# EAGLE design CONTROL PROJECT (EAGLE 7.7.0)
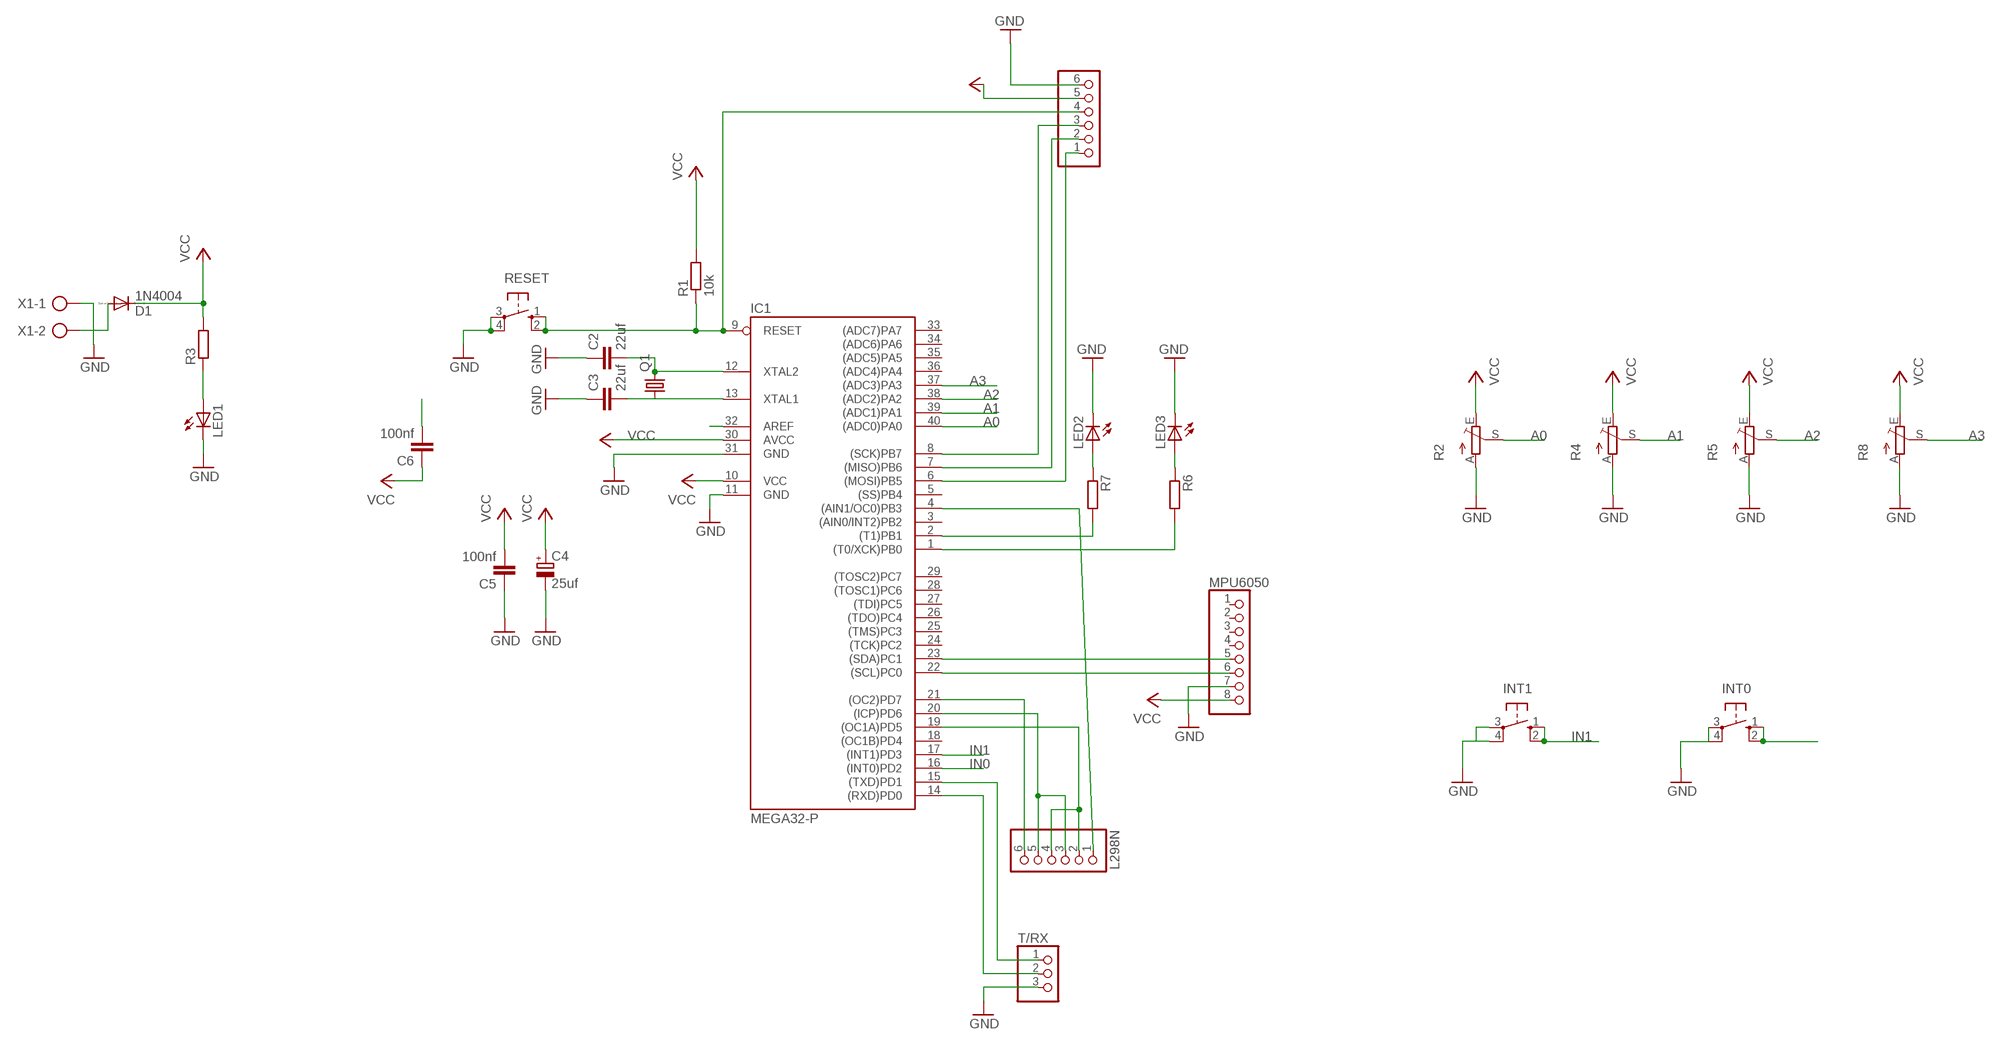
[diagram p0: schematic, sheet 1]

## Parts
C2  22uf  C-EU050-025X075  [C050-025X075]
C3  22uf  C-EU050-025X075  [C050-025X075]
C4  25uf  CPOL-EUE1.8-4  [E1,8-4]
C5  100nf  C-EU050-025X075  [C050-025X075]
C6  100nf  C-EU050-025X075  [C050-025X075]
D1  1N4004  [DO41-10]
IC1  MEGA32-P  [DIL40]
INT0  10-XX  [B3F-10XX]
INT1  10-XX  [B3F-10XX]
L298N  PINHD-1X6  [1X06]
LED1  LED5MM  [LED5MM]
LED2  LED5MM  [LED5MM]
LED3  LED5MM  [LED5MM]
MPU6050  PINHD-1X8  [1X08]
PROG  PINHD-1X6  [1X06]
Q1  CRYSTALHC49U-V  [HC49U-V]
R1  10k  R-EU_0207/7  [0207/7]
R2  TRIM_EU-RJ6  [RJ6]
R3  R-EU_0207/7  [0207/7]
R4  TRIM_EU-RJ6  [RJ6]
R5  TRIM_EU-RJ6  [RJ6]
R6  R-EU_0207/7  [0207/7]
R7  R-EU_0207/7  [0207/7]
R8  TRIM_EU-RJ6  [RJ6]
RESET  10-XX  [B3F-10XX]
T/RX  PINHD-1X3  [1X03]
X1  AK300/2  [AK300/2]

## Nets
A0: IC1.40((ADC0)PA0) R2.S
A1: IC1.39((ADC1)PA1) R4.S
A2: IC1.38((ADC2)PA2) R5.S
A3: IC1.37((ADC3)PA3) R8.S
AREF: C6.2 IC1.32(AREF)
GND: C2.1 C3.1 C4.- C5.1 IC1.11(GND) IC1.31(GND) INT0.3(P) INT0.4(P1) INT1.3(P) INT1.4(P1) LED1.K(C) LED2.K(C) LED3.K(C) MPU6050.7 PROG.6 R2.A R4.A R5.A R8.A RESET.3(P) RESET.4(P1) T/RX.3 X1.1
IN0: IC1.16((INT0)PD2) INT0.1(S) INT0.2(S1)
IN1: IC1.17((INT1)PD3) INT1.1(S) INT1.2(S1)
MISO: IC1.7((MISO)PB6) PROG.2
MOSI: IC1.6((MOSI)PB5) PROG.1
N$2: C2.2 IC1.12(XTAL2) Q1.2
N$3: C3.2 IC1.13(XTAL1) Q1.1
N$4: IC1.2((T1)PB1) R7.2
N$5: LED1.A R3.1
N$6: D1.A X1.2
N$7: IC1.1((T0/XCK)PB0) R6.2
N$8: LED3.A R6.1
N$9: LED2.A R7.1
N$12: IC1.19((OC1A)PD5) L298N.2 L298N.4
N$14: IC1.20((ICP)PD6) L298N.3 L298N.5
OC0: IC1.4((AIN1/OC0)PB3) L298N.1
OC2: IC1.21((OC2)PD7) L298N.6
RESET: IC1.9(RESET) PROG.4 R1.1 RESET.1(S) RESET.2(S1)
RX: IC1.14((RXD)PD0) T/RX.2
SCK: IC1.8((SCK)PB7) PROG.3
SCL: IC1.22((SCL)PC0) MPU6050.6
SDA: IC1.23((SDA)PC1) MPU6050.5
TX: IC1.15((TXD)PD1) T/RX.1
VCC: C4.+ C5.2 C6.1 D1.C IC1.10(VCC) IC1.30(AVCC) MPU6050.8 PROG.5 R1.2 R2.E R3.2 R4.E R5.E R8.E
Unconnected: IC1.3((AIN0/INT2)PB2) IC1.5((SS)PB4) IC1.18((OC1B)PD4) IC1.24((TCK)PC2) IC1.25((TMS)PC3) IC1.26((TDO)PC4) IC1.27((TDI)PC5) IC1.28((TOSC1)PC6) IC1.29((TOSC2)PC7) IC1.33((ADC7)PA7) IC1.34((ADC6)PA6) IC1.35((ADC5)PA5) IC1.36((ADC4)PA4) MPU6050.1 MPU6050.2 MPU6050.3 MPU6050.4

## Library data of the parts
C2 C3 C5 C6 = rcl:C-EU: CAPACITOR, European symbol
C4 = resistor:CPOL-EU: POLARIZED CAPACITOR, European symbol
D1 = diode:1N4004: DIODE general purpose rectifier, 1 A
IC1 = atmel:MEGA32-P: MICROCONTROLLER 32 Kbytes FLASH 2 Kbytes SRAM 1 Kbytes EEPROM USART 8-channel 10 bit ADC Source: www.atmel.com .. doc2503.pdf; MPN: ATMEGA32-16PU; OC_FARNELL: 1661729; OC_NEWARK: 51P1794
INT0 INT1 RESET = switch-omron:10-XX: OMRON SWITCH; MPN: B3F-1000; OC_FARNELL: 176432; OC_NEWARK: 36M3542
L298N PROG = pinhead:PINHD-1X6: PIN HEADER
LED1-LED3 = led:LED: LED OSRAM: - CHIPLED LG R971, LG N971, LY N971, LG Q971, LY Q971, LO R971, LY R971 LH N974, LH R974 LS Q976, LO Q976, LY Q976 LO Q996 - Hyper CHIPLED LW Q18S LB Q993, LB Q99A, LB R99A - SideLED LS A670, LO A670, LY A670, LG A670, LP A670 LB A673, LV A673, LT A673, LW A673 LH A674 LY A675 LS A676, LA A676, LO A676, LY A676, LW A676 LS A679, LY A679, LG A679 - Hyper Micro SIDELED® LS Y876, LA Y876, LO Y876, LY Y876 LT Y87S - SmartLED LW L88C, LW L88S LB L89C, LB L89S, LG L890 LS L89K, LO L89K, LY L89K LS L896, LA L896, LO L896, LY L896 - TOPLED LS T670, LO T670, LY T670, LG T670, LP T670 LSG T670, LSP T670, LSY T670, LOP T670, LYG T670 LG T671, LOG T671, LSG T671 LB T673, LV T673, LT T673, LW T673 LH T674 LS T676, LA T676, LO T676, LY T676, LB T676, LH T676, LSB T676, LW T676 LB T67C, LV T67C, LT T67C, LS T67K, LO T67K, LY T67K, LW E67C LS E67B, LA E67B, LO E67B, LY E67B, LB E67C, LV E67C, LT E67C LW T67C LS T679, LY T679, LG T679 LS T770, LO T770, LY T770, LG T770, LP T770 LB T773, LV T773, LT T773, LW T773 LH T774 LS E675, LA E675, LY E675, LS T675 LS T776, LA T776, LO T776, LY T776, LB T776 LHGB T686 LT T68C, LB T68C - Hyper Mini TOPLED® LB M676 - Mini TOPLED Santana® LG M470 LS M47K, LO M47K, LY M47K Source: http://www.osram.convergy.de LUXEON: - LUMILED® LXK2-PW12-R00, LXK2-PW12-S00, LXK2-PW14-U00, LXK2-PW14-V00 LXK2-PM12-R00, LXK2-PM12-S00, LXK2-PM14-U00 LXK2-PE12-Q00, LXK2-PE12-R00, LXK2-PE12-S00, LXK2-PE14-T00, LXK2-PE14-U00 LXK2-PB12-K00, LXK2-PB12-L00, LXK2-PB12-M00, LXK2-PB14-N00, LXK2-PB14-P00, LXK2-PB14-Q00 LXK2-PR12-L00, LXK2-PR12-M00, LXK2-PR14-Q00, LXK2-PR14-R00 LXK2-PD12-Q00, LXK2-PD12-R00, LXK2-PD12-S00 LXK2-PH12-R00, LXK2-PH12-S00 LXK2-PL12-P00, LXK2-PL12-Q00, LXK2-PL12-R00 Source: www.luxeon.com KINGBRIGHT: KA-3528ASYC Source: www.kingbright.com
MPU6050 = pinhead@1:PINHD-1X8: PIN HEADER
Q1 = crystal:CRYSTAL: CRYSTAL; OC_FARNELL: 1666969; OC_NEWARK: unknown
R1 R3 R6 R7 = rcl:R-EU_: RESISTOR, European symbol
R2 R4 R5 R8 = pot:TRIM_EU-: POTENTIOMETER
T/RX = pinhead:PINHD-1X3: PIN HEADER
X1 = con-ptr500:AK300/2: CONNECTOR; OC_FARNELL: unknown; OC_NEWARK: unknown

## Board
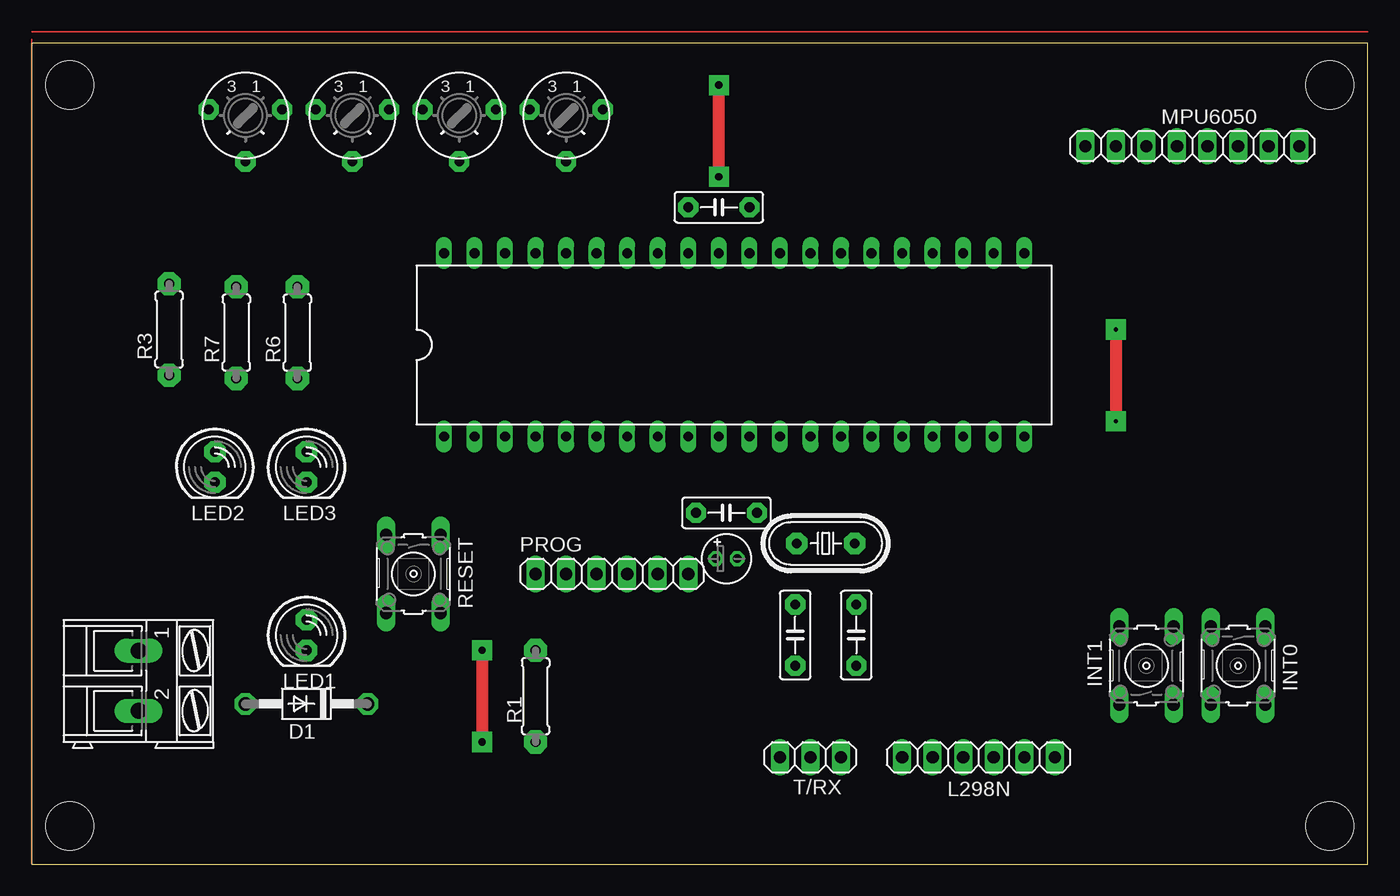
[diagram p1: board, top side]
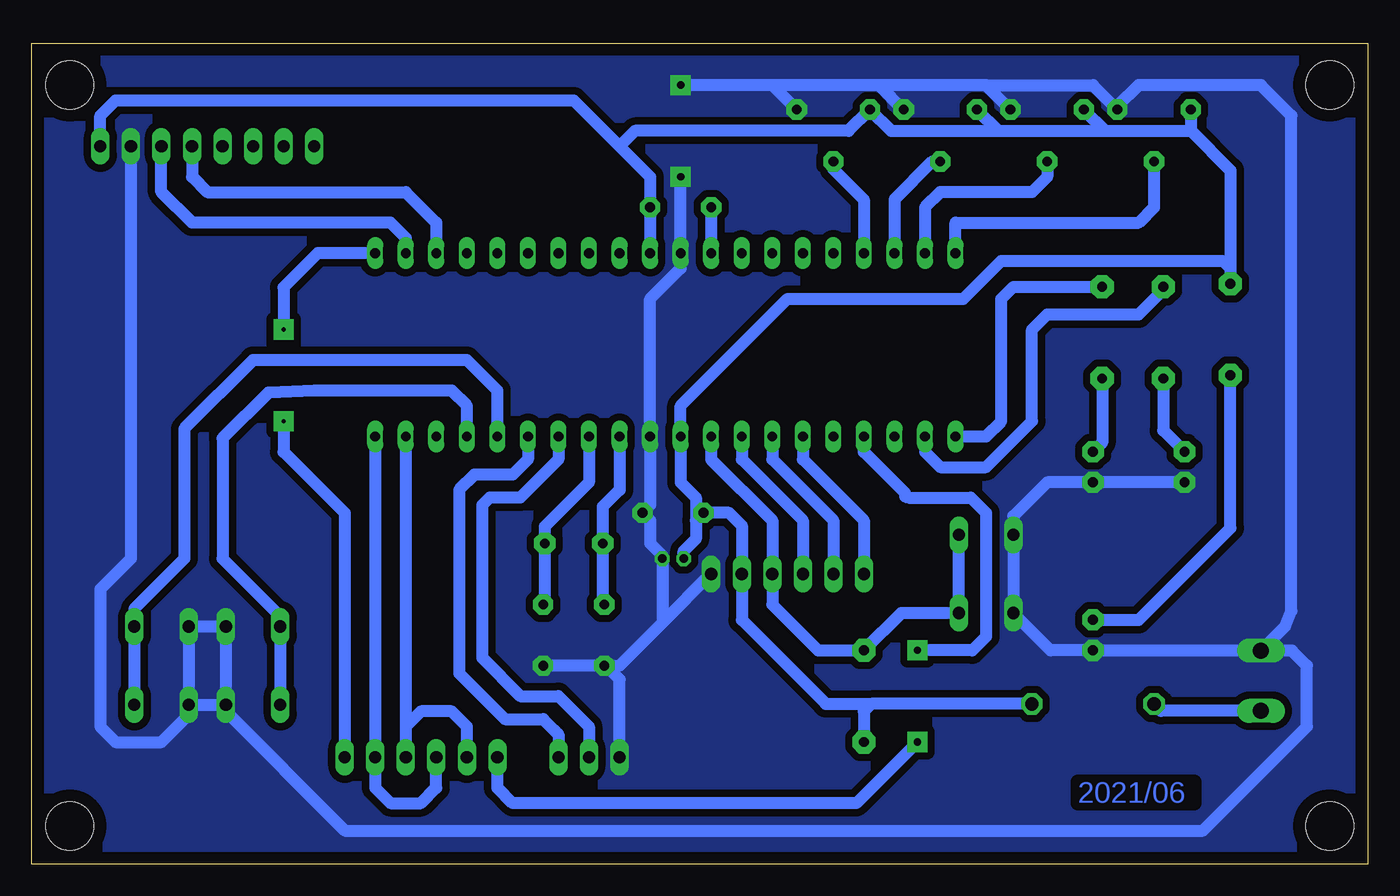
[diagram p2: board, bottom side, seen from below]

Size 111.11 x 68.25 mm. Coordinates in mm from the lower left corner, seen from the top.
Outline: 0,0 111.11,0 111.11,68.25 0,68.25 0,0
Copper layers (1*16): Top 0.035mm / dielectric 1.5mm / Bottom 0.035mm
Design rules "myDRC *": minimum track width 32mil, minimum drill 24mm, track to track 16mil, track to pad 16mil, pad to pad 16mil, via to via 16mil, smd to smd 16mil, copper to edge 40mil, drill to drill 4mil, minimum pad ring 10mil, minimum via ring 8mil, stop-mask expansion 4mil, vias tented up to drill 0mil, thermal gap 10mil
Holes 4 mm at 3.18,64.77 3.18,3.17 107.95,3.17 107.95,64.77

### Footprints (pad centres in the part's own frame; a part is rotated, then mirrored left to right if it is on the bottom)
C050-025X075 = drill 0.813 pad 1.676 octagon: 1 -2.54,0; 2 2.54,0
E1,8-4 = drill 0.711 pad 1.168 octagon: + -0.889,0; - 0.889,0
DO41-10 = drill 1.118 pad 1.778 octagon: A 5.08,0; C -5.08,0
DIL40 = drill 0.813 long: 1 -24.13,-7.62; 2 -21.59,-7.62; 3 -19.05,-7.62; 4 -16.51,-7.62; 5 -13.97,-7.62; 6 -11.43,-7.62; 7 -8.89,-7.62; 8 -6.35,-7.62; 9 -3.81,-7.62; 10 -1.27,-7.62; 11 1.27,-7.62; 12 3.81,-7.62; 13 6.35,-7.62; 14 8.89,-7.62; 15 11.43,-7.62; 16 13.97,-7.62; 17 16.51,-7.62; 18 19.05,-7.62; 19 21.59,-7.62; 20 24.13,-7.62; 21 24.13,7.62; 22 21.59,7.62; 23 19.05,7.62; 24 16.51,7.62; 25 13.97,7.62; 26 11.43,7.62; 27 8.89,7.62; 28 6.35,7.62; 29 3.81,7.62; 30 1.27,7.62; 31 -1.27,7.62; 32 -3.81,7.62; 33 -6.35,7.62; 34 -8.89,7.62; 35 -11.43,7.62; 36 -13.97,7.62; 37 -16.51,7.62; 38 -19.05,7.62; 39 -21.59,7.62; 40 -24.13,7.62
B3F-10XX = drill 1.016 long: 1 -3.251,2.261; 2 3.251,2.261; 3 -3.251,-2.261; 4 3.251,-2.261
1X06 = drill 1.016 long: 1 -6.35,0; 2 -3.81,0; 3 -1.27,0; 4 1.27,0; 5 3.81,0; 6 6.35,0
LED5MM = drill 0.813 pad 1.778 octagon: A -1.27,0; K 1.27,0
1X08 = drill 1.016 long: 1 -8.89,0; 2 -6.35,0; 3 -3.81,0; 4 -1.27,0; 5 1.27,0; 6 3.81,0; 7 6.35,0; 8 8.89,0
HC49U-V = drill 0.813 pad 1.778 octagon: 1 -2.413,0; 2 2.413,0
0207/7 = drill 0.813 pad 1.93 octagon: 1 -3.81,0; 2 3.81,0
RJ6 = drill 0.813 pad 1.676 octagon: A -3.048,-0.508; E 3.048,-0.508; S 0,3.81
1X03 = drill 1.016 long: 1 -2.54,0; 2 0,0; 3 2.54,0
AK300/2 = drill 1.321 long: 1 -2.515,0; 2 2.489,0

### Placement (x,y rotation side)
C2  63.5,19.05 90 top
C3  68.58,19.05 90 top
C4  57.78,25.4 0 top
C5  57.78,29.21 180 top
C6  57.15,54.61 180 top
D1  22.86,13.34 180 top
IC1  58.42,43.18 0 top
INT0  100.33,16.51 270 top
INT1  92.71,16.51 90 top
L298N  78.74,8.89 0 top
LED1  22.86,19.05 270 top
LED2  15.24,33.02 270 top
LED3  22.86,33.02 270 top
MPU6050  96.52,59.69 0 top
PROG  48.26,24.13 0 top
Q1  66.04,26.67 180 top
R1  41.91,13.97 270 top
R2  17.78,62.23 180 top
R3  11.43,44.45 90 top
R4  26.67,62.23 180 top
R5  35.56,62.23 180 top
R6  22.1,44.2 90 top
R7  17.02,44.2 90 top
R8  44.45,62.23 180 top
RESET  31.75,24.13 270 top
T/RX  64.77,8.89 180 top
X1  8.89,15.24 270 top

### Tracks (layer width: path | path; a pad name or v marks a point on that pad's centre or on a via)
A0
  Bottom 1.016: R2.S 17.78,54.61 19.05,53.34 34.29,53.34 IC1.40
A1
  Bottom 1.016: R4.S 26.67,57.15 27.94,55.88 35.56,55.88 36.83,54.61 IC1.39
A2
  Bottom 1.016: R5.S 36.2,58.42 39.37,55.24 IC1.38
A3
  Bottom 1.016: R8.S 44.45,57.78 41.91,55.24 IC1.37
AREF
  Bottom 1.016: C6.2 IC1.32
GND  (via drill 0.6 pad 1.68)
  Top 1.016: v57.15,57.15 v57.15,64.77
  Bottom 1.016: 31.75,64.77 40.64,64.77 | 31.75,64.77 22.86,64.77 R2.A 20.83,62.99 19.05,64.77 8.89,64.77 6.35,62.23 6.35,21.03 6.87,19.77 X1.1 | R4.A 31.75,64.77 | R5.A 40.64,64.77 | LED2.K LED3.K 26.67,31.75 29.49,28.93 RESET.3 RESET.4 26.39,17.78 LED1.K 22.84,17.76 X1.1 | C2.1 C3.1 | T/RX.3 62.23,15.37 63.37,16.51 C2.1 | 95.25,13.97 94.97,14.25 INT1.4 INT0.3 INT0.4 | MPU6050.7 102.87,25.4 105.41,22.86 105.41,11.43 104.14,10.16 100.33,10.16 98.07,12.42 INT0.4 | 8.87,17.76 X1.1 | INT0.4 INT1.3 95.25,13.26 95.25,12.95 85.09,2.79 13.72,2.79 5.08,11.43 5.08,16.51 6.32,17.76 X1.1 | v57.15,57.15 IC1.31 57.15,49.53 59.69,46.99 IC1.11 59.69,29.84 C5.1 59.69,28.58 59.69,26.67 58.67,25.65 C4.- 58.67,20.07 | C2.1 62.23,16.51 58.67,20.07 | 58.67,20.07 PROG.6 | 40.64,64.77 49.53,64.77 | 49.53,64.77 v57.15,64.77 | R8.A 49.53,64.77
  pour Bottom (isolate 0.61, no thermals): -1.27,70.48 120.14,70.48 121.28,69.34 121.28,-5.08 1.14,-5.08 0,-3.94 -0.64,-3.3 -1.27,-2.67
IN0
  Bottom 1.016: IC1.16 72.39,39.37 74.93,41.91 92.71,41.91 98.42,36.2 98.42,25.4 102.59,21.23 INT0.1 INT0.2
IN1
  Bottom 1.016: IC1.17 74.93,38.1 76.2,39.37 87.63,39.37 91.43,39.21 95.25,35.39 95.25,25.4 90.45,20.6 INT1.2 INT1.1
MISO
  Bottom 1.016: IC1.7 49.53,33.66 44.45,28.58 PROG.2
MOSI
  Bottom 1.016: IC1.6 46.99,33.66 41.91,28.58 PROG.1
N$2
  Bottom 1.016: IC1.12 62.23,31.12 63.63,29.72 Q1.2 63.63,21.72 C2.2
N$3
  Bottom 1.016: IC1.13 64.77,31.75 68.45,28.07 Q1.1 68.45,21.72 C3.2
N$4
  Bottom 1.016: IC1.2 36.83,34.29 35.56,33.02 31.75,33.02 27.94,36.83 27.94,44.45 26.67,45.72 19.05,45.72 17.02,47.75 R7.2
N$5
  Bottom 1.016: R3.1 11.43,27.94 19.05,20.32 LED1.A
N$6
  Bottom 1.016: X1.2 17.2,12.75 D1.A
N$7
  Bottom 1.016: IC1.1 31.75,35.56 30.48,36.83 30.48,46.99 29.46,48.01 R6.2
N$8
  Bottom 1.016: R6.1 22.1,35.05 LED3.A
N$9
  Bottom 1.016: R7.1 17.02,36.07 LED2.A
N$12
  Bottom 1.016: IC1.19 80.01,12.7 80.01,11.43 | 80.01,11.43 L298N.4 | L298N.2 74.93,11.43 76.2,12.7 78.74,12.7 80.01,11.43
N$14
  Bottom 1.016: IC1.20 L298N.5 82.55,6.35 81.28,5.08 78.74,5.08 77.47,6.35 L298N.3
OC0  (via drill 0.6 pad 1.68)
  Top 1.016: v37.46,17.78 v37.46,10.16
  Bottom 1.016: L298N.1 72.39,6.35 71.12,5.08 42.54,5.08 v37.46,10.16 | v37.46,17.78 32.89,17.78 31.75,18.92 31.75,29.21 33.02,30.48 38.19,30.48 38.46,30.59 38.46,30.84 41.91,34.29 IC1.4
OC2  (via drill 0.35 pad 1.68)
  Top 1.016: v90.17,44.45 v90.17,36.83
  Bottom 1.016: L298N.6 85.09,29.21 90.17,34.29 v90.17,36.83 | IC1.21 87.33,50.8 90.17,47.96 v90.17,44.45
RESET
  Bottom 1.016: RESET.1 RESET.2 38.81,20.88 R1.1 45.72,17.78 49.53,21.59 PROG.4 49.53,28.58 54.61,33.66 IC1.9
RX
  Bottom 1.016: IC1.14 67.31,33.66 70.48,30.48 71.75,30.48 72.14,30.48 73.02,30.48 73.66,29.84 73.66,17.14 70.48,13.97 67.31,13.97 64.77,11.43 T/RX.2
SCK
  Bottom 1.016: IC1.8 52.07,33.66 46.99,28.58 PROG.3
SCL
  Bottom 1.016: IC1.22 80.01,52.07 81.28,53.34 97.79,53.34 100.33,55.88 MPU6050.6
SDA
  Bottom 1.016: MPU6050.5 97.79,57.15 96.52,55.88 80.01,55.88 77.47,53.34 IC1.23
TX
  Bottom 1.016: IC1.15 69.85,33.66 71.12,32.38 74.3,32.38 75.56,31.12 75.56,15.88 71.75,12.07 68.58,12.07 67.63,11.11 67.31,10.79 T/RX.1
VCC
  Bottom 1.016: R2.E 14.73,60.96 | R4.E 21.84,60.96 | 21.84,60.96 14.73,60.96 | R5.E 30.73,60.96 | 30.73,60.96 21.84,60.96 | IC1.30 C6.1 59.69,57.15 62.23,59.69 | MPU6050.8 105.41,62.23 104.14,63.5 66.04,63.5 62.23,59.69 | 30.73,60.96 39.62,60.96 R8.E 43.18,60.96 60.96,60.96 62.23,59.69 | 14.73,60.96 11.43,57.66 R3.2 11.43,49.53 12.06,50.16 30.48,50.16 33.66,46.99 48.26,46.99 57.15,38.1 IC1.10 57.15,31.75 55.88,30.48 55.88,28.58 | 55.88,28.58 C5.2 53.12,29.21 52.07,28.16 PROG.5 52.07,20.32 45.09,13.34 41.27,13.34 | 55.88,28.58 55.88,27.05 56.9,26.03 C4.+ | D1.C 41.27,13.34 | 41.27,13.34 41.91,12.7 R1.2
(copper drawn outside any net)
  shapes: Top area x2

### Text on the board
Bottom: 2021/06